# Altium schematic sheet Top.SchDoc
size A4
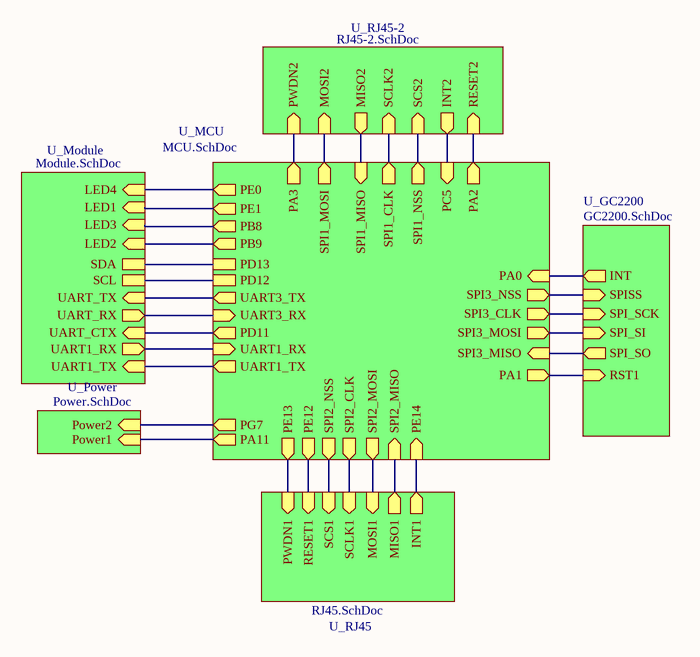
[diagram p0: Top.SchDoc]

## Sub-sheets
U_GC2200 = GC2200.SchDoc: SPISS (in), SPI_SCK (in), SPI_SI (in), SPI_SO (out), RST1 (in), INT (out)
U_MCU = MCU.SchDoc: SPI1_NSS (out), SPI1_CLK (out), SPI1_MISO (in), SPI1_MOSI (out), SPI2_NSS (out), SPI2_CLK (out), SPI2_MISO (in), SPI2_MOSI (out), SPI3_CLK (out), SPI3_MOSI (out), SPI3_NSS (out), SPI3_MISO (in), PA3 (out), PC5 (in), PE13 (out), PE12 (out), PE14 (in), PA1 (out), PA2 (out), PA0 (in), UART1_TX (out), UART1_RX (in), UART3_TX (out), UART3_RX (in), PD11 (out), PD12, PD13, PG7 (out), PA11 (out), PE0 (out), PE1 (out), PB8 (out), PB9 (out)
U_Module = Module.SchDoc: UART_RX (out), UART_TX (in), UART_CTX (in), SCL, SDA, UART1_TX (in), UART1_RX (out), LED2 (in), LED3 (in), LED1 (in), LED4 (in)
U_Power = Power.SchDoc: Power1 (in), Power2 (in)
U_RJ45 = RJ45.SchDoc: INT1 (out), SCS1 (in), SCLK1 (in), MOSI1 (in), MISO1 (out), PWDN1 (in), RESET1 (in)
U_RJ45-2 = RJ45-2.SchDoc: INT2 (out), SCS2 (in), SCLK2 (in), MOSI2 (in), MISO2 (out), PWDN2 (in), RESET2 (in)

## Nets
(unnamed): sheet U_GC2200/SPISS, sheet U_MCU/SPI3_NSS
(unnamed): sheet U_GC2200/SPI_SCK, sheet U_MCU/SPI3_CLK
(unnamed): sheet U_GC2200/SPI_SI, sheet U_MCU/SPI3_MOSI
(unnamed): sheet U_GC2200/SPI_SO, sheet U_MCU/SPI3_MISO
(unnamed): sheet U_GC2200/RST1, sheet U_MCU/PA1
(unnamed): sheet U_GC2200/INT, sheet U_MCU/PA0
(unnamed): sheet U_MCU/SPI1_NSS, sheet U_RJ45-2/SCS2
(unnamed): sheet U_MCU/SPI1_CLK, sheet U_RJ45-2/SCLK2
(unnamed): sheet U_MCU/SPI1_MISO, sheet U_RJ45-2/MISO2
(unnamed): sheet U_MCU/SPI1_MOSI, sheet U_RJ45-2/MOSI2
(unnamed): sheet U_MCU/SPI2_NSS, sheet U_RJ45/SCS1
(unnamed): sheet U_MCU/SPI2_CLK, sheet U_RJ45/SCLK1
(unnamed): sheet U_MCU/SPI2_MISO, sheet U_RJ45/MISO1
(unnamed): sheet U_MCU/SPI2_MOSI, sheet U_RJ45/MOSI1
(unnamed): sheet U_MCU/PA3, sheet U_RJ45-2/PWDN2
(unnamed): sheet U_MCU/PC5, sheet U_RJ45-2/INT2
(unnamed): sheet U_MCU/PE13, sheet U_RJ45/PWDN1
(unnamed): sheet U_MCU/PE12, sheet U_RJ45/RESET1
(unnamed): sheet U_MCU/PE14, sheet U_RJ45/INT1
(unnamed): sheet U_MCU/PA2, sheet U_RJ45-2/RESET2
(unnamed): sheet U_MCU/UART1_TX, sheet U_Module/UART1_TX
(unnamed): sheet U_MCU/UART1_RX, sheet U_Module/UART1_RX
(unnamed): sheet U_MCU/UART3_TX, sheet U_Module/UART_TX
(unnamed): sheet U_MCU/UART3_RX, sheet U_Module/UART_RX
(unnamed): sheet U_MCU/PD11, sheet U_Module/UART_CTX
(unnamed): sheet U_MCU/PD12, sheet U_Module/SCL
(unnamed): sheet U_MCU/PD13, sheet U_Module/SDA
(unnamed): sheet U_MCU/PG7, sheet U_Power/Power2
(unnamed): sheet U_MCU/PA11, sheet U_Power/Power1
(unnamed): sheet U_MCU/PE0, sheet U_Module/LED4
(unnamed): sheet U_MCU/PE1, sheet U_Module/LED1
(unnamed): sheet U_MCU/PB8, sheet U_Module/LED3
(unnamed): sheet U_MCU/PB9, sheet U_Module/LED2